# EAGLE schematic verteiler (EAGLE 6.5.0)
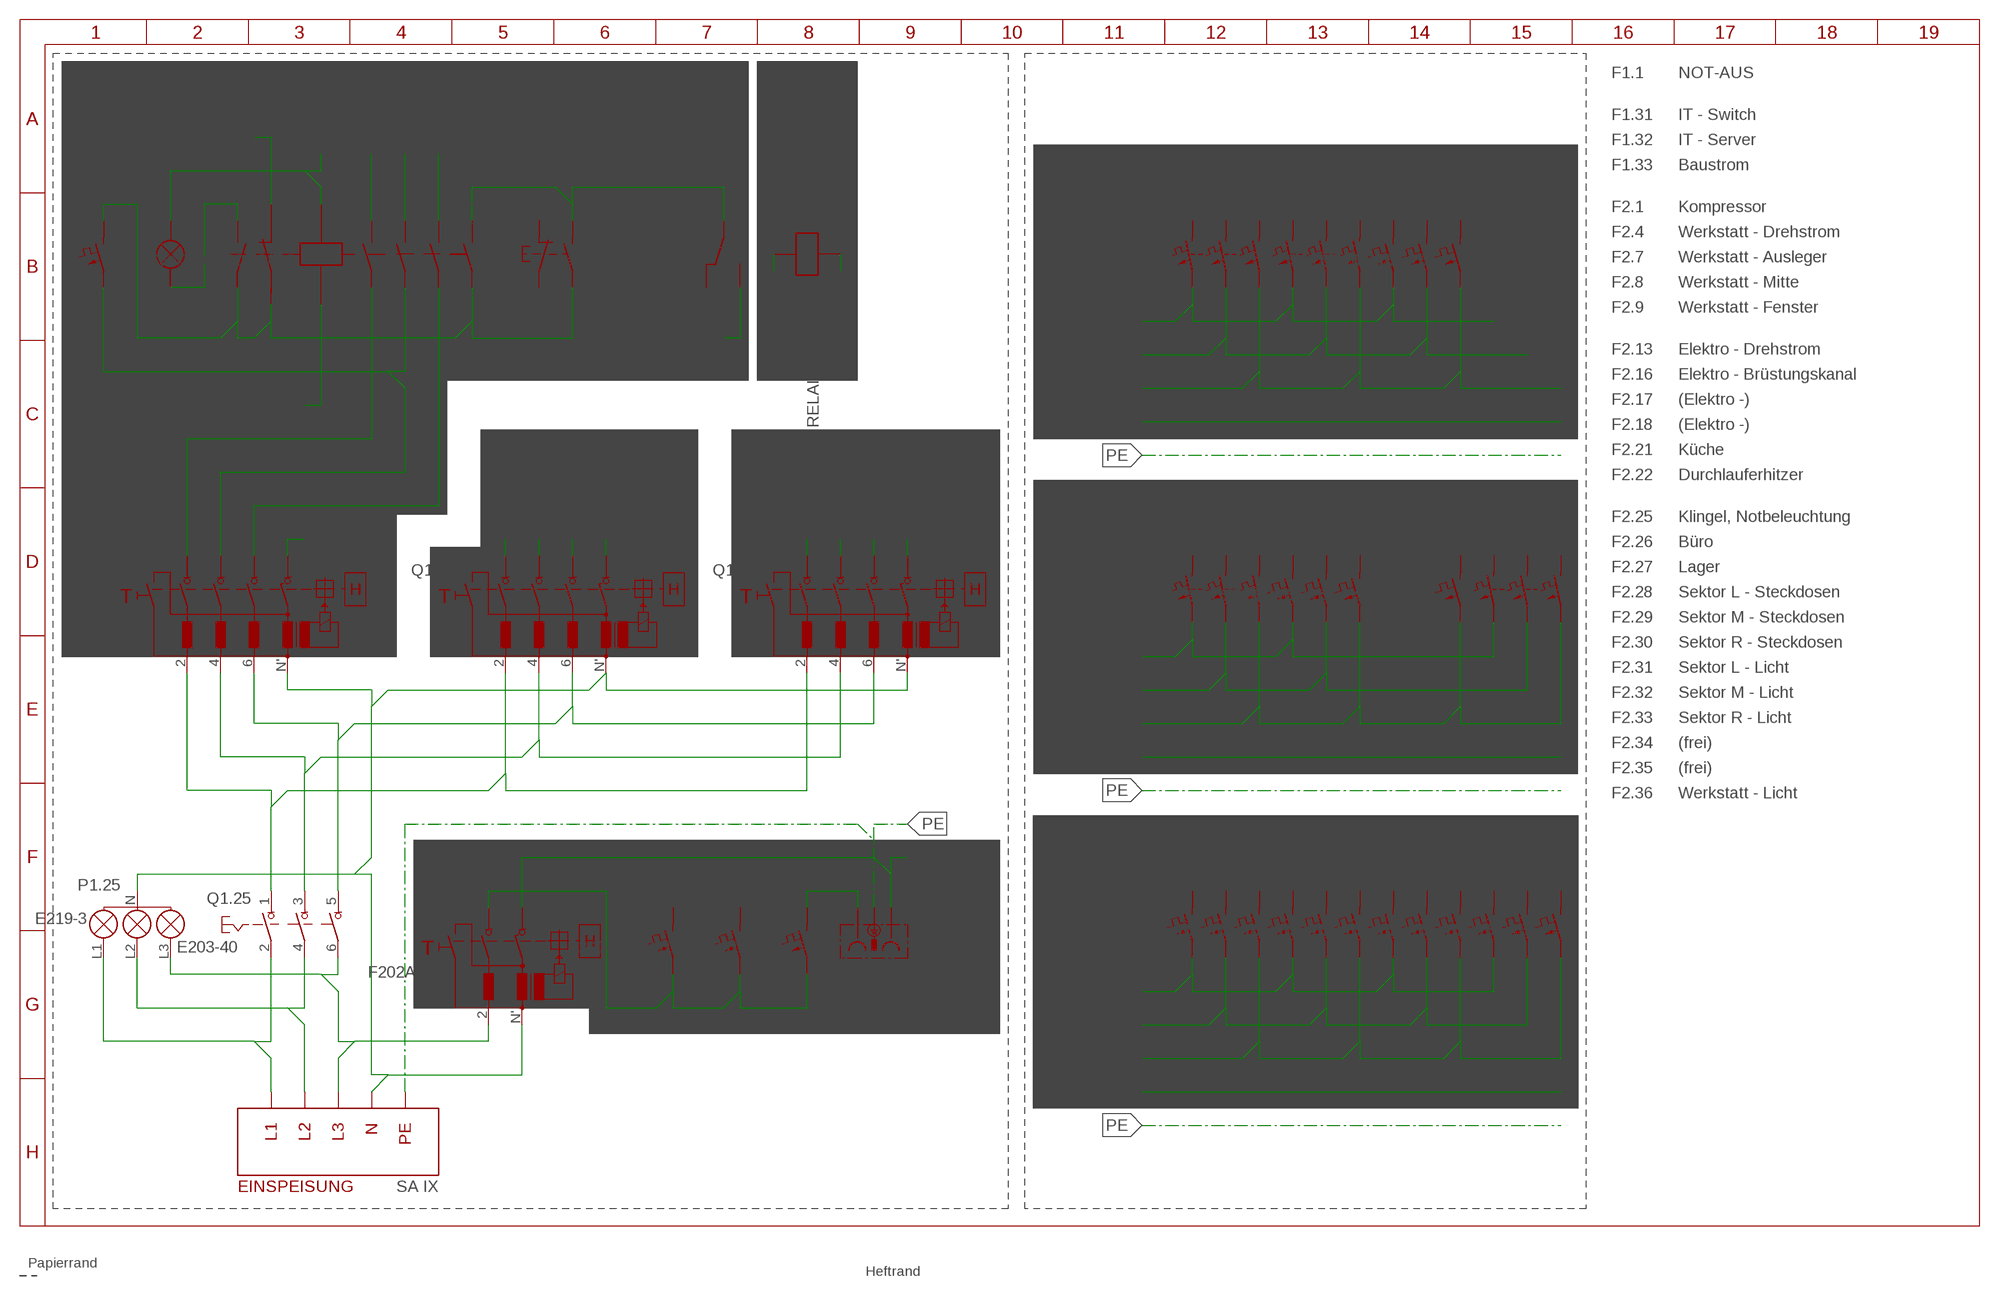
[diagram p0: schematic, sheet 1]

## Parts
F1.1  LEITUNGSSCHUTZSCHALTER  [LEITUNGSSCHUTZSCHALTER]
F1.31  S201-B16  LEITUNGSSCHUTZSCHALTER  [LEITUNGSSCHUTZSCHALTER]
F1.32  S201-B16  LEITUNGSSCHUTZSCHALTER  [LEITUNGSSCHUTZSCHALTER]
F1.33  S201-B16  LEITUNGSSCHUTZSCHALTER  [LEITUNGSSCHUTZSCHALTER]
F2.1  LEITUNGSSCHUTZSCHALTER_3-POL  [LEITUNGSSCHUTZSCHALTER_3-POL]
F2.4  LEITUNGSSCHUTZSCHALTER_3-POL  [LEITUNGSSCHUTZSCHALTER_3-POL]
F2.7  S201-B16  LEITUNGSSCHUTZSCHALTER  [LEITUNGSSCHUTZSCHALTER]
F2.8  S201-B16  LEITUNGSSCHUTZSCHALTER  [LEITUNGSSCHUTZSCHALTER]
F2.9  S201-B16  LEITUNGSSCHUTZSCHALTER  [LEITUNGSSCHUTZSCHALTER]
F2.13  LEITUNGSSCHUTZSCHALTER_3-POL  [LEITUNGSSCHUTZSCHALTER_3-POL]
F2.16  S201-B16  LEITUNGSSCHUTZSCHALTER  [LEITUNGSSCHUTZSCHALTER]
F2.17  S201-B16  LEITUNGSSCHUTZSCHALTER  [LEITUNGSSCHUTZSCHALTER]
F2.18  S201-B16  LEITUNGSSCHUTZSCHALTER  [LEITUNGSSCHUTZSCHALTER]
F2.21  S201-B16  LEITUNGSSCHUTZSCHALTER  [LEITUNGSSCHUTZSCHALTER]
F2.22  LEITUNGSSCHUTZSCHALTER_3-POL  [LEITUNGSSCHUTZSCHALTER_3-POL]
F2.25  S201-B16  LEITUNGSSCHUTZSCHALTER  [LEITUNGSSCHUTZSCHALTER]
F2.26  S201-B16  LEITUNGSSCHUTZSCHALTER  [LEITUNGSSCHUTZSCHALTER]
F2.27  S201-B16  LEITUNGSSCHUTZSCHALTER  [LEITUNGSSCHUTZSCHALTER]
F2.28  S201-B16  LEITUNGSSCHUTZSCHALTER  [LEITUNGSSCHUTZSCHALTER]
F2.29  S201-B16  LEITUNGSSCHUTZSCHALTER  [LEITUNGSSCHUTZSCHALTER]
F2.30  S201-B16  LEITUNGSSCHUTZSCHALTER  [LEITUNGSSCHUTZSCHALTER]
F2.31  S201-B16  LEITUNGSSCHUTZSCHALTER  [LEITUNGSSCHUTZSCHALTER]
F2.32  S201-B16  LEITUNGSSCHUTZSCHALTER  [LEITUNGSSCHUTZSCHALTER]
F2.33  S201-B16  LEITUNGSSCHUTZSCHALTER  [LEITUNGSSCHUTZSCHALTER]
F2.34  S201-B16  LEITUNGSSCHUTZSCHALTER  [LEITUNGSSCHUTZSCHALTER]
F2.35  S201-B16  LEITUNGSSCHUTZSCHALTER  [LEITUNGSSCHUTZSCHALTER]
F2.36  S201-B16  LEITUNGSSCHUTZSCHALTER  [LEITUNGSSCHUTZSCHALTER]
K1.3  ESB63-40-230AC/DC  ESB-40  [ESB_40/63]
K1.7  RELAIS_2-POL-UM  [RELAIS_2-POL-UM]
P1.2  SIGNALLAMPE  [LAMPE]
P1.25  E219-3  [E219-3*]
Q1.13  FEHLER-STROM-SCHUTZSCHALTER_4-POL  [FEHLER-STROM-SCHUTZSCHALTER_4-POL]
Q1.17  FEHLER-STROM-SCHUTZSCHALTER_4-POL  [FEHLER-STROM-SCHUTZSCHALTER_4-POL]
Q1.21  FEHLER-STROM-SCHUTZSCHALTER_4-POL  [FEHLER-STROM-SCHUTZSCHALTER_4-POL]
Q1.25  E203-40  LASTTRENNSCHALTER_3-POL  [LASTTRENNSCHALTER_3-POL]
Q1.28  F202A-40  FEHLER-STROM-SCHUTZSCHALTER_2-POL  [FEHLER-STROM-SCHUTZSCHALTER_2-POL]
S1.6  TASTER_1_SCHLIESSER+1_OEFFNER  [SCHALTER_1-SCHLIESSER_1-OEFFNER]
X1.34  STECKDOSE  [STECKDOSE]

## Nets
F1.1: F1.1.1 K1.3.8(14) K1.3.22 K1.3.34 S1.6.24
F1.32: F1.33.1 X1.34.L1
F2.36: K1.7.A2
L1-EXT: P1.25.L1 Q1.25.2
L1-K1.3: K1.3.1
L1-Q1.13: K1.3.2 Q1.13.1
L1-Q1.17: F2.13.2 F2.16.2 F2.22.2 Q1.17.1
L1-Q1.21: F2.25.2 F2.28.2 F2.31.2 F2.34.2 Q1.21.1
L1-Q1.28: F1.31.2 F1.32.2 F1.33.2 Q1.28.1
L2-EXT: P1.25.L2 Q1.25.4
L2-K1.3: F2.1.4 F2.4.4 F2.8.2 K1.3.3
L2-Q1.13: F1.1.2 K1.3.4 Q1.13.3
L2-Q1.17: F2.13.4 F2.17.2 F2.22.4 Q1.17.3
L2-Q1.21: F2.26.2 F2.29.2 F2.32.2 F2.35.2 Q1.21.3
L3-EXT: Q1.28.2
L3-K1.3: F2.1.6 F2.4.6 F2.9.2 K1.3.5
L3-Q1.13: K1.3.6 Q1.13.5
L3-Q1.17: F2.13.6 F2.18.2 F2.21.2 F2.22.6 Q1.17.5
L3-Q1.21: F2.27.2 F2.30.2 F2.33.2 F2.36.2 Q1.21.5
N$1: Q1.13.6 Q1.17.6 Q1.21.6 Q1.25.5
N$2: F2.1.2 F2.4.2 F2.7.2
N$4: K1.3.33 P1.2.2(X2)
N$5: Q1.13.4 Q1.17.4 Q1.21.4 Q1.25.3
N$6: Q1.13.2 Q1.17.2 Q1.21.2 Q1.25.1
N$7: P1.25.L3 Q1.25.6
N-EXT: P1.25.N Q1.13.N' Q1.17.N' Q1.21.N' Q1.28.N'
N-Q1.13: K1.3.A1 P1.2.1(X1) Q1.13.N
N-Q1.17: Q1.17.N
N-Q1.21: K1.7.A1 Q1.21.N
N-Q1.28: Q1.28.N X1.34.N
NOTAUS-RETURN: K1.3.A2
NOTAUS-SEND: K1.7.14
NOTAUS-SEND-INT: K1.3.7(13) K1.7.11 S1.6.23
NOTAUS-SIGNAL: K1.3.21
PE: X1.34.PE
Unconnected: F1.31.1 F1.32.1 F2.1.1 F2.1.3 F2.1.5 F2.4.1 F2.4.3 F2.4.5 F2.7.1 F2.8.1 F2.9.1 F2.13.1 F2.13.3 F2.13.5 F2.16.1 F2.17.1 F2.18.1 F2.21.1 F2.22.1 F2.22.3 F2.22.5 F2.25.1 F2.26.1 F2.27.1 F2.28.1 F2.29.1 F2.30.1 F2.31.1 F2.32.1 F2.33.1 F2.34.1 F2.35.1 F2.36.1 K1.7.12 K1.7.21 K1.7.22 K1.7.24 S1.6.11 S1.6.12

## Notes on the sheet
- F1.1 | NOT-AUS
- F1.31 | IT - Switch
- F1.32 | IT - Server
- F1.33 | Baustrom
- F2.1 | Kompressor
- F2.4 | Werkstatt - Drehstrom
- F2.7 | Werkstatt - Ausleger
- F2.8 | Werkstatt - Mitte
- F2.9 | Werkstatt - Fenster
- F2.13 | Elektro - Drehstrom
- F2.16 | Elektro - Brüstungskanal
- F2.17 | (Elektro -)
- F2.18 | (Elektro -)
- F2.21 | Küche
- F2.22 | Durchlauferhitzer
- F2.25 | Klingel, Notbeleuchtung
- F2.26 | Büro
- F2.27 | Lager
- F2.28 | Sektor L - Steckdosen
- F2.29 | Sektor M - Steckdosen
- F2.30 | Sektor R - Steckdosen
- F2.31 | Sektor L - Licht
- F2.32 | Sektor M - Licht
- F2.33 | Sektor R - Licht
- F2.34 | (frei)
- F2.35 | (frei)
- F2.36 | Werkstatt - Licht
- SA IX

## Library data of the parts
F1.1 F1.31-F1.33 F2.7-F2.9 F2.16-F2.18 F2.21 F2.25-F2.36 = e-sicherungen:LEITUNGSSCHUTZSCHALTER: Sicherung
F2.1 F2.4 F2.13 F2.22 = e-sicherungen:LEITUNGSSCHUTZSCHALTER_3-POL: Leitungsschutzschalter, 3-pol.
K1.3 = ABB:ESB*-40
K1.7 = e-schuetze-relais:RELAIS_2-POL-UM: Relais mit 2 Wechsleschalter
P1.2 = e-lampen-signalisation:SIGNALLAMPE: Lampe
P1.25 = ABB:E219-3*
Q1.13 Q1.17 Q1.21 = e-sicherungen:FEHLER-STROM-SCHUTZSCHALTER_4-POL: Fehlerstromschutzschalter (FI) 4-pol mit Prüftaster
Q1.25 = e-schalter:LASTTRENNSCHALTER_3-POL: Lasttrennschalter, 3-pol.
Q1.28 = e-sicherungen:FEHLER-STROM-SCHUTZSCHALTER_2-POL: Fehlerstromschutzschalter (FI) 2-pol mit Prüftaste
S1.6 = e-schalter:TASTER_1_SCHLIESSER+1_OEFFNER: Taster, 1 Schließer, 1 Öffner
X1.34 = e-steckverbinder:STECKDOSE: Steckdose mit Schutzleiter